# EAGLE design flasher (EAGLE 6.4)
LED flasher light replacement
Assembly variants: Simple, Dimmed
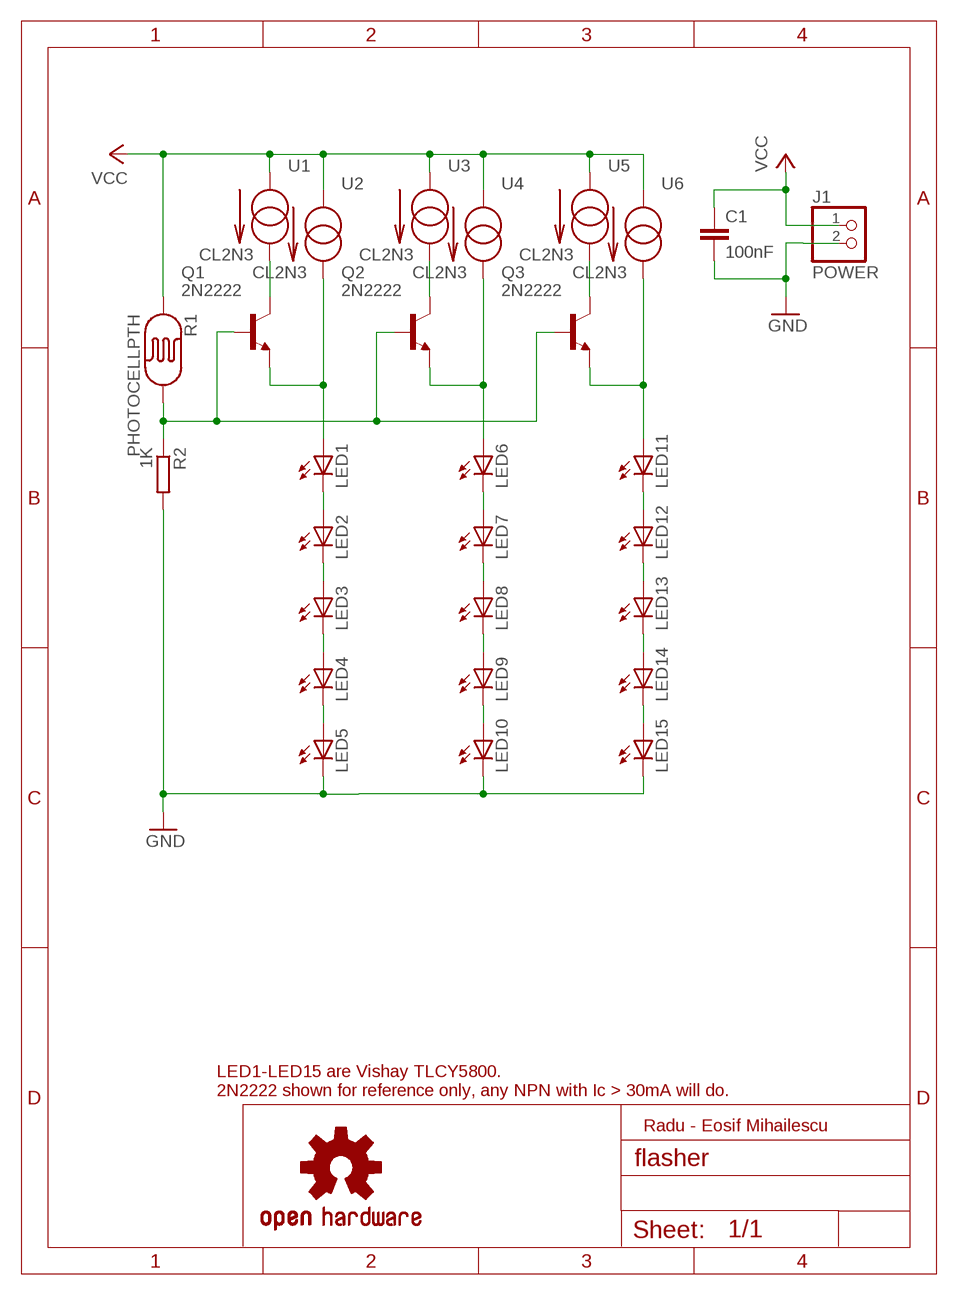
[diagram p0: schematic, sheet 1]

## Parts
C1  100nF  C-EU050-025X075  [C050-025X075]
J1  POWER  PINHD-1X2/90  [1X02/90]
LED1  LED5MM  [LED5MM]
LED2  LED5MM  [LED5MM]
LED3  LED5MM  [LED5MM]
LED4  LED5MM  [LED5MM]
LED5  LED5MM  [LED5MM]
LED6  LED5MM  [LED5MM]
LED7  LED5MM  [LED5MM]
LED8  LED5MM  [LED5MM]
LED9  LED5MM  [LED5MM]
LED10  LED5MM  [LED5MM]
LED11  LED5MM  [LED5MM]
LED12  LED5MM  [LED5MM]
LED13  LED5MM  [LED5MM]
LED14  LED5MM  [LED5MM]
LED15  LED5MM  [LED5MM]
LOGO1  OSHW-LOGOL  [OSHW-LOGO-L]
Q1  2N2222  2N2222-NPN-TO92-EBC  [TO92-EBC]  (not fitted in variant Simple)
Q2  2N2222  2N2222-NPN-TO92-EBC  [TO92-EBC]  (not fitted in variant Simple)
Q3  2N2222  2N2222-NPN-TO92-EBC  [TO92-EBC]  (not fitted in variant Simple)
R1  PHOTOCELLPTH  [PHOTOCELL]  (not fitted in variant Simple)
R2  1K  R-EU_0204/7  [0204/7]  (not fitted in variant Simple)
U1  CL2N3  [TO-92]
U2  CL2N3  [TO-92]
U3  CL2N3  [TO-92]
U4  CL2N3  [TO-92]
U5  CL2N3  [TO-92]
U6  CL2N3  [TO-92]

## Nets
GND [power]: C1.2 J1.2 LED5.K(C) LED10.K(C) LED15.K(C) R2.2
N$1 [power]: LED1.K(C) LED2.A
N$2 [power]: LED2.K(C) LED3.A
N$3 [power]: LED3.K(C) LED4.A
N$4 [power]: LED1.A Q1.E U2.3(OUT)
N$5 [power]: LED4.K(C) LED5.A
N$6 [power]: Q1.C U1.3(OUT)
N$7 [power]: Q2.C U3.3(OUT)
N$8 [power]: LED6.K(C) LED7.A
N$9 [power]: LED7.K(C) LED8.A
N$10 [power]: LED8.K(C) LED9.A
N$11 [power]: LED6.A Q2.E U4.3(OUT)
N$12 [power]: LED9.K(C) LED10.A
N$13 [power]: Q3.C U5.3(OUT)
N$14 [power]: LED11.K(C) LED12.A
N$15 [power]: LED12.K(C) LED13.A
N$16 [power]: LED13.K(C) LED14.A
N$17 [power]: LED11.A Q3.E U6.3(OUT)
N$18 [power]: LED14.K(C) LED15.A
SENSE [signal]: Q1.B Q2.B Q3.B R1.2 R2.1
VCC [power]: C1.1 J1.1 R1.1 U1.1(IN) U2.1(IN) U3.1(IN) U4.1(IN) U5.1(IN) U6.1(IN)

## Notes on the sheet
- LED1-LED15 are Vishay TLCY5800.
  2N2222 shown for reference only, any NPN with Ic > 30mA will do.
- Radu - Eosif Mihailescu

## Library data of the parts
C1 = rcl:C-EU: CAPACITOR, European symbol
J1 = pinhead:PINHD-1X2: PIN HEADER
LED1-LED15 = led:LED: LED OSRAM: - CHIPLED LG R971, LG N971, LY N971, LG Q971, LY Q971, LO R971, LY R971 LH N974, LH R974 LS Q976, LO Q976, LY Q976 LO Q996 - Hyper CHIPLED LW Q18S LB Q993, LB Q99A, LB R99A - SideLED LS A670, LO A670, LY A670, LG A670, LP A670 LB A673, LV A673, LT A673, LW A673 LH A674 LY A675 LS A676, LA A676, LO A676, LY A676, LW A676 LS A679, LY A679, LG A679 - Hyper Micro SIDELED® LS Y876, LA Y876, LO Y876, LY Y876 LT Y87S - SmartLED LW L88C, LW L88S LB L89C, LB L89S, LG L890 LS L89K, LO L89K, LY L89K LS L896, LA L896, LO L896, LY L896 - TOPLED LS T670, LO T670, LY T670, LG T670, LP T670 LSG T670, LSP T670, LSY T670, LOP T670, LYG T670 LG T671, LOG T671, LSG T671 LB T673, LV T673, LT T673, LW T673 LH T674 LS T676, LA T676, LO T676, LY T676, LB T676, LH T676, LSB T676, LW T676 LB T67C, LV T67C, LT T67C, LS T67K, LO T67K, LY T67K, LW E67C LS E67B, LA E67B, LO E67B, LY E67B, LB E67C, LV E67C, LT E67C LW T67C LS T679, LY T679, LG T679 LS T770, LO T770, LY T770, LG T770, LP T770 LB T773, LV T773, LT T773, LW T773 LH T774 LS E675, LA E675, LY E675, LS T675 LS T776, LA T776, LO T776, LY T776, LB T776 LHGB T686 LT T68C, LB T68C - Hyper Mini TOPLED® LB M676 - Mini TOPLED Santana® LG M470 LS M47K, LO M47K, LY M47K Source: http://www.osram.convergy.de LUXEON: - LUMILED® LXK2-PW12-R00, LXK2-PW12-S00, LXK2-PW14-U00, LXK2-PW14-V00 LXK2-PM12-R00, LXK2-PM12-S00, LXK2-PM14-U00 LXK2-PE12-Q00, LXK2-PE12-R00, LXK2-PE12-S00, LXK2-PE14-T00, LXK2-PE14-U00 LXK2-PB12-K00, LXK2-PB12-L00, LXK2-PB12-M00, LXK2-PB14-N00, LXK2-PB14-P00, LXK2-PB14-Q00 LXK2-PR12-L00, LXK2-PR12-M00, LXK2-PR14-Q00, LXK2-PR14-R00 LXK2-PD12-Q00, LXK2-PD12-R00, LXK2-PD12-S00 LXK2-PH12-R00, LXK2-PH12-S00 LXK2-PL12-P00, LXK2-PL12-Q00, LXK2-PL12-R00 Source: www.luxeon.com KINGBRIGHT: KA-3528ASYC Source: www.kingbright.com
LOGO1 = SparkFun-Aesthetics:OSHW-LOGO: Open Source Hardware Logo This logo indicates the piece of hardware it is found on incorporates a OSHW license and/or adheres to the definition of open source hardware found here: http://freedomdefined.org/OSHW
Q1-Q3 = transistor-neu-to92:*-NPN-: NPN Transistror
R1 = SparkFun-Sensors:PHOTOCELL: CdS photoresistor. This is a low cost way to detect light levels. Resistance decreases with more incoming light. SparkFun SKU: SEN-09088
R2 = rcl:R-EU_: RESISTOR, European symbol
U1-U6 = radu-collected:CL2*: Supertex CL2 20mA thermocompensated constant current source for driving LEDs

## Net classes
0 default: clearance 0.355 mm
1 power: width 1.27 mm, clearance 0.508 mm
2 signal: width 0.254 mm, clearance 0.254 mm

## Board
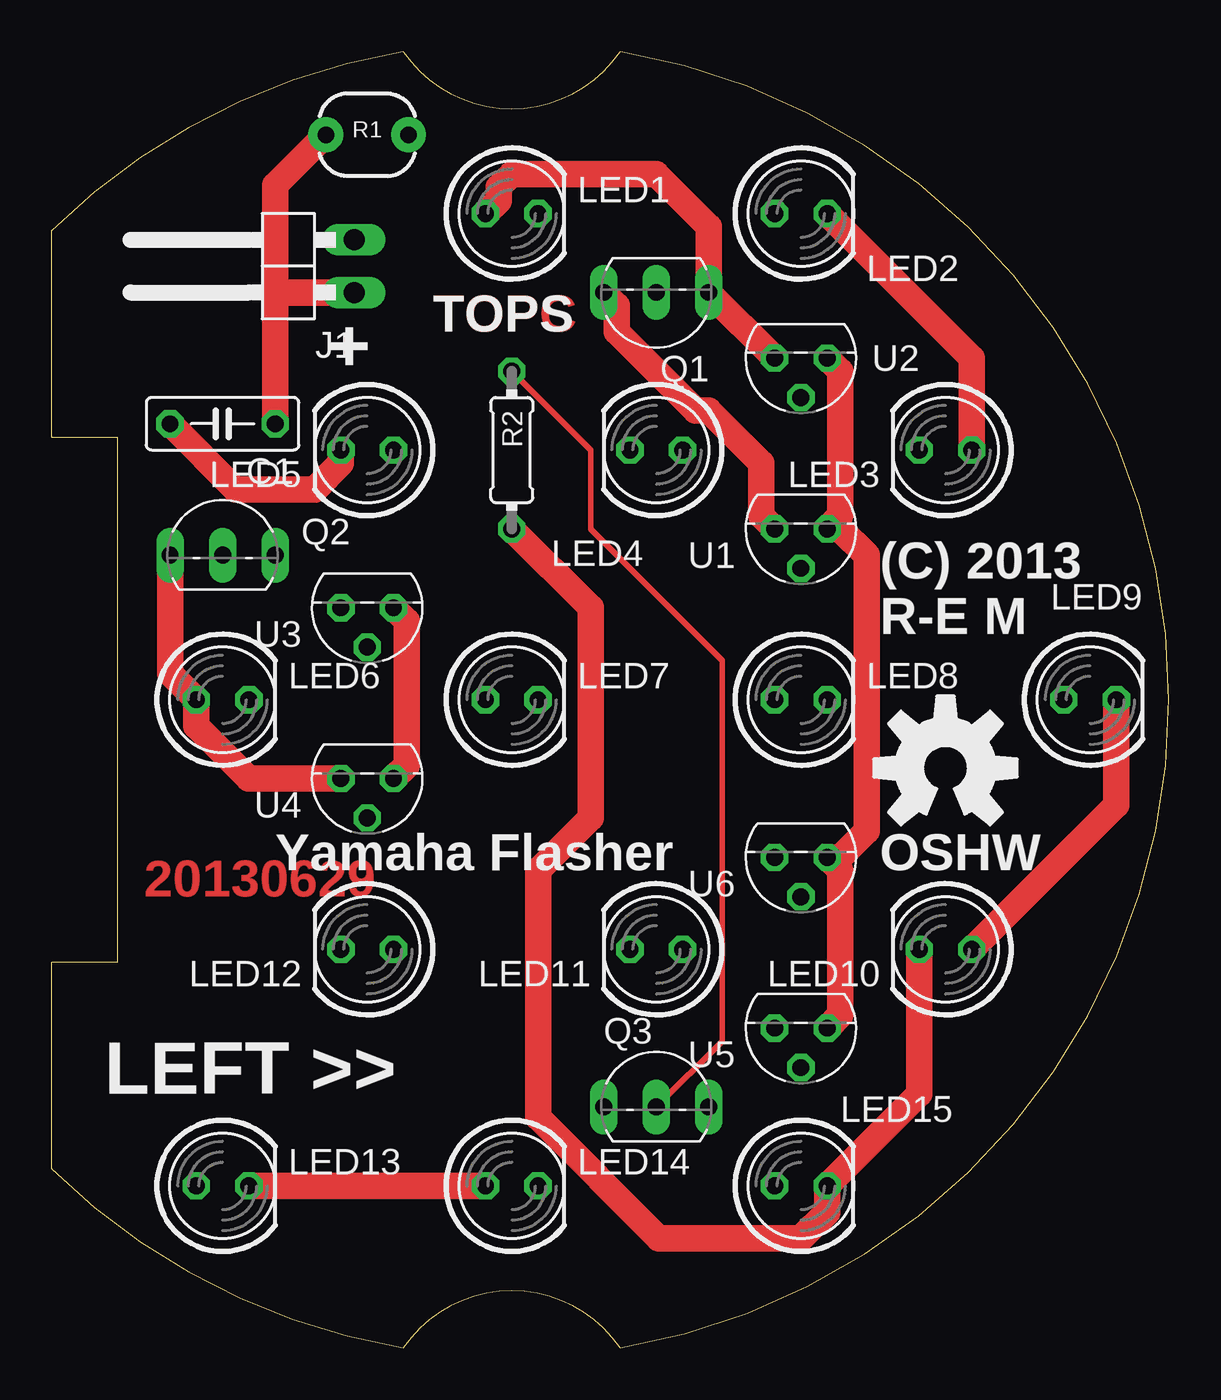
[diagram p1: board, top side]
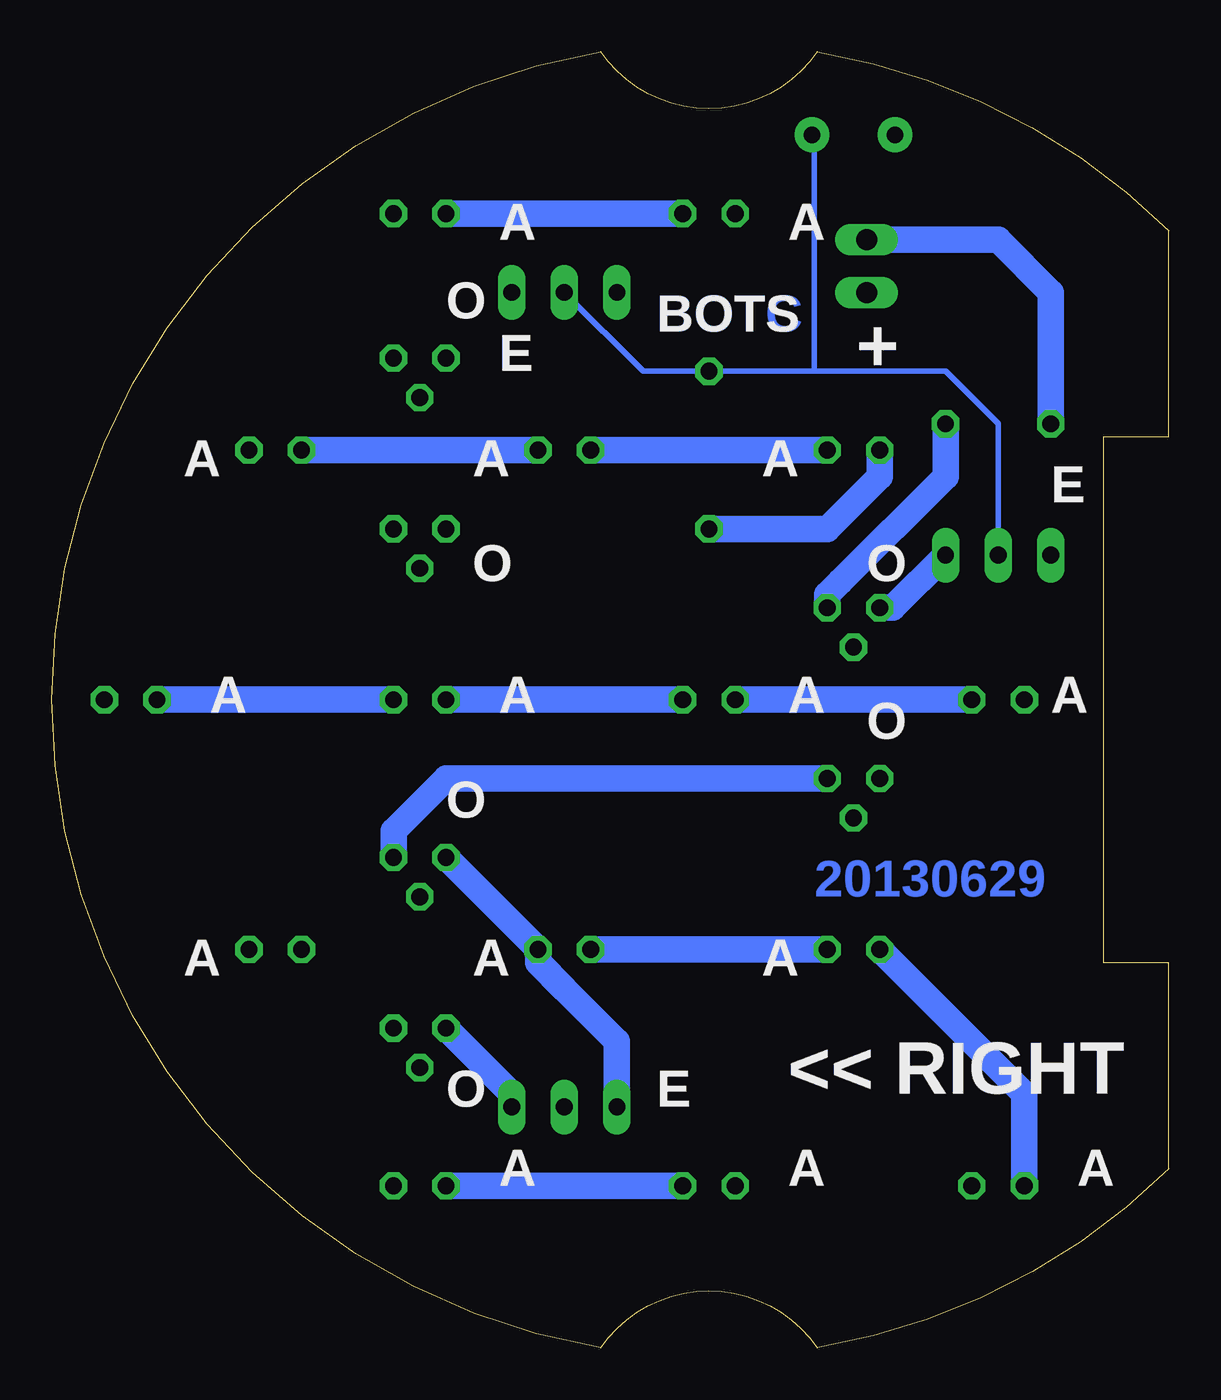
[diagram p2: board, bottom side, seen from below]

Size 53.98 x 62.64 mm. Coordinates in mm from the lower left corner, seen from the top.
Outline: 0,54 arc-35 16.99,62.64 arc111 27.46,62.64 arc-161 27.46,0 arc111 16.99,0
Outline: 16.99,0 arc-35 0,8.64 0,18.62 3.17,18.62 3.17,44.02 0,44.02 0,54
Copper layers (1*16): Top 0.035mm / dielectric 1.5mm / Bottom 0.035mm
Design rules "ITEADstudio_DRC": minimum track width 10mil, minimum drill 12mil, track to track 10mil, track to pad 10mil, pad to pad 10mil, via to via 10mil, smd to smd 0mil, copper to edge 20mil, drill to drill 10mil, minimum pad ring 10mil, minimum via ring 6mil, stop-mask expansion 4mil, vias tented up to drill 100mil, thermal gap 10mil

### Footprints (pad centres in the part's own frame; a part is rotated, then mirrored left to right if it is on the bottom)
C050-025X075 = drill 0.813 octagon: 1 -2.54,0; 2 2.54,0
1X02/90 = drill 1.016 long: 1 -1.27,-3.81; 2 1.27,-3.81
LED5MM = drill 0.813 octagon: A -1.27,0; K 1.27,0
TO92-EBC = drill 0.813 long: B 0,-1.27; C 2.54,-1.27; E -2.54,-1.27
PHOTOCELL = drill 0.8 pad 1.676: 1 -2,0; 2 2,0
0204/7 = drill 0.813 octagon: 1 -3.81,0; 2 3.81,0
TO-92 = drill 0.813 octagon: 1 -1.27,0; 2 0,1.905; 3 1.27,0

### Placement (x,y rotation side)
C1  8.26,44.66 180 top
J1  10.79,52.28 90 top
LED1  22.22,54.82 0 top
LED2  36.2,54.82 0 top
LED3  43.18,43.39 180 top
LED4  29.21,43.39 180 top
LED5  15.24,43.39 180 top
LED6  8.26,31.32 0 top
LED7  22.22,31.32 0 top
LED8  36.2,31.32 0 top
LED9  50.16,31.32 0 top
LED10  43.18,19.26 180 top
LED11  29.21,19.26 180 top
LED12  15.24,19.26 180 top
LED13  8.26,7.83 0 top
LED14  22.22,7.83 0 top
LED15  36.2,7.83 0 top
LOGO1  43.18,28.02 0 top
Q1  29.21,49.74 180 top
Q2  8.26,39.58 0 top
Q3  29.21,12.91 0 top
R1  15.24,58.63 0 top
R2  22.22,43.39 270 top
U1  36.2,39.58 180 top
U2  36.2,47.83 180 top
U3  15.24,35.77 180 top
U4  15.24,27.51 180 top
U5  36.2,15.45 180 top
U6  36.2,23.7 180 top

### Tracks (layer width: path | path; a pad name or v marks a point on that pad's centre or on a via)
GND
  Top 1.27: LED10.K 41.91,12.27 LED15.K 37.47,6.56 36.2,5.29 29.34,5.29 23.49,11.13 23.49,12.91 23.49,23.07 26.04,25.61 26.04,35.77 R2.2 | C1.2 8.89,41.48 12.7,41.48 13.97,42.75 LED5.K
  Bottom 1.27: R2.2 16.51,39.58 13.97,42.12 LED5.K | J1.2 8.26,53.55 5.71,51.01 C1.2
N$1
  Bottom 1.27: LED2.A LED1.K
N$2
  Top 1.27: LED3.A 44.45,47.83 LED2.K
N$3
  Bottom 1.27: LED3.K LED4.A
N$4
  Top 1.27: LED1.A 21.59,55.45 21.59,56.09 22.22,56.72 29.21,56.72 31.75,54.18 Q1.E U2.3
N$5
  Bottom 1.27: LED4.K LED5.A
N$6
  Top 1.27: Q1.C 27.3,50.37 27.3,49.1 31.11,45.29 31.75,45.29 34.29,42.75 34.29,40.21 U1.3
N$7
  Bottom 1.27: U3.3 13.34,35.77 Q2.C
N$8
  Bottom 1.27: LED7.A LED6.K
N$9
  Bottom 1.27: LED8.A LED7.K
N$10
  Bottom 1.27: LED9.A LED8.K
N$11
  Top 1.27: Q2.E 5.71,32.59 LED6.A 6.99,30.05 9.53,27.51 U4.3
N$12
  Top 1.27: LED10.A 51.44,26.24 LED9.K
N$13
  Bottom 1.27: U5.3 31.75,12.27 Q3.C
N$14
  Bottom 1.27: LED11.K LED12.A
N$15
  Bottom 1.27: LED13.A 6.99,12.27 LED12.K
N$16
  Top 1.27: LED14.A LED13.K
N$17
  Bottom 1.27: Q3.E 26.67,14.81 29.21,17.35 30.48,18.62 LED11.A U6.3
N$18
  Bottom 1.27: LED15.A LED14.K
SENSE
  Top 0.254: R2.1 26.04,43.39 26.04,39.58 32.39,33.23 32.39,15.45 32.39,14.81 Q3.B
  Bottom 0.254: 17.14,47.2 10.79,47.2 8.26,44.66 Q2.B | 17.14,47.2 R2.1 25.4,47.2 Q1.B | 17.14,47.2 17.14,58.63 R1.2
VCC
  Top 1.27: U2.1 38.1,47.2 38.1,40.21 U1.1 38.1,39.58 39.37,38.31 39.37,24.97 38.1,23.7 U6.1 38.1,23.07 38.1,16.08 U5.1 | U4.1 17.14,28.15 17.14,35.13 U3.1 | R1.1 10.79,56.18 10.79,51.01 | 10.79,51.01 C1.1 | J1.1 10.79,51.01
  Bottom 1.27: U4.1 34.93,27.51 37.47,24.97 U6.1 | C1.1 10.79,42.12 15.88,37.04 16.51,36.4 U3.1

### Text on the board
Top: TOPC | 20130629
Bottom: BOTC | 20130629
tPlace: TOPS | + | (C) 2013 / R-E M | Yamaha Flasher | OSHW | LEFT >>
bPlace: A | A | O | BOTS | + | E | A | A | A | E | O | O | A | A | A | A | O | O | A | A | A | << RIGHT | E | O | A | A | A